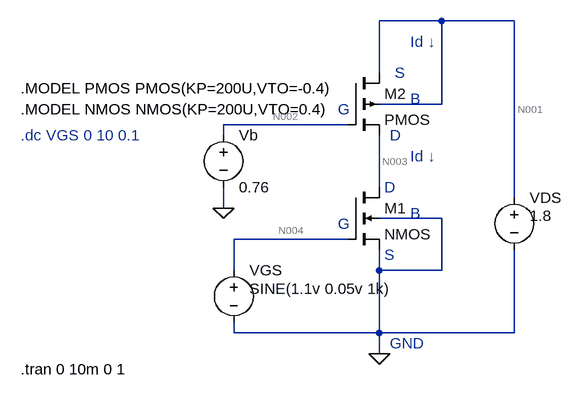
[diagram p0: schematic NMOS-PMOS.asc]
NMOS-PMOS.asc, the LTspice schematic file:
Version 4
SHEET 1 880 680
WIRE 224 -192 128 -192
WIRE 336 -192 224 -192
WIRE 128 -112 128 -192
WIRE 224 -64 224 -192
WIRE 224 -64 128 -64
WIRE 80 -32 -112 -32
WIRE -112 -16 -112 -32
WIRE 128 64 128 -16
WIRE 336 80 336 -192
WIRE -112 96 -112 64
WIRE 224 112 128 112
WIRE 80 144 -96 144
WIRE -96 192 -96 144
WIRE 128 192 128 160
WIRE 224 192 224 112
WIRE 224 192 128 192
WIRE -96 288 -96 272
WIRE 128 288 128 192
WIRE 128 288 -96 288
WIRE 336 288 336 160
WIRE 336 288 128 288
WIRE 128 320 128 288
FLAG 128 320 0
FLAG -112 96 0
DATAFLAG 128 16 ""
SYMBOL nmos4 80 64 R0
SYMATTR InstName M1
SYMATTR Value2 l=1u w=100u
SYMBOL voltage 336 64 R0
WINDOW 3 24 44 Left 2
WINDOW 123 0 0 Left 0
WINDOW 39 0 0 Left 0
SYMATTR Value 1.8
SYMATTR InstName VDS
SYMBOL voltage -96 176 R0
WINDOW 3 24 44 Left 2
WINDOW 123 0 0 Left 0
WINDOW 39 0 0 Left 0
SYMATTR Value SINE(1.1v 0.05v 1k)
SYMATTR InstName VGS
SYMBOL pmos4 80 -112 R0
SYMATTR InstName M2
SYMATTR Value2 l=1u w=146u
SYMBOL voltage -112 -32 R0
WINDOW 123 0 0 Left 0
WINDOW 39 0 0 Left 0
SYMATTR InstName Vb
SYMATTR Value 0.76
TEXT 136 64 Left 2 ;D
TEXT 64 120 Left 2 ;G
TEXT 136 168 Left 2 ;S
TEXT 176 104 Left 2 ;B
TEXT 144 304 Left 2 ;GND
TEXT 176 16 Left 2 ;Id ↓
TEXT -424 -56 Left 2 !.MODEL NMOS NMOS(KP=200U,VTO=0.4)
TEXT -424 344 Left 2 !.tran 0 10m 0 1
TEXT 144 -16 Left 2 ;D
TEXT 64 -56 Left 2 ;G
TEXT 152 -112 Left 2 ;S
TEXT 176 -72 Left 2 ;B
TEXT 176 -160 Left 2 ;Id ↓
TEXT -424 -16 Left 2 ;.dc VGS 0 10 0.1
TEXT -424 -88 Left 2 !.MODEL PMOS PMOS(KP=200U,VTO=-0.4)

The netlist it stands for:
* NMOS-PMOS.asc
M1 N003 N004 0 0 NMOS l=1u w=100u
VDS N001 0 1.8
VGS N004 0 SINE(1.1v 0.05v 1k)
M2 N001 N002 N003 N001 PMOS l=1u w=146u
Vb N002 0 0.76
.model NMOS NMOS
.model PMOS PMOS
.lib standard.mos
* D
* G
* S
* B
* GND
* Id ↓
.MODEL NMOS NMOS(KP=200U,VTO=0.4)
.tran 0 10m 0 1
* D
* G
* S
* B
* Id ↓
* .dc VGS 0 10 0.1
.MODEL PMOS PMOS(KP=200U,VTO=-0.4)
.backanno
.end

* Results of the author's LTspice run, read from the files saved beside the schematic
* Operating Point, zero values left out:
*   V(n003) = 1.432 V
*   V(n004) = 1.1 V
*   V(n001) = 1.8 V
*   V(n002) = 760 mV
*   Id(M2) = 4.9 mA
*   Is(M2) = -4.9 mA
*   Id(M1) = 4.9 mA
*   Ib(M1) = -1.442 pA
*   Is(M1) = -4.9 mA
*   I(Vds) = -4.9 mA
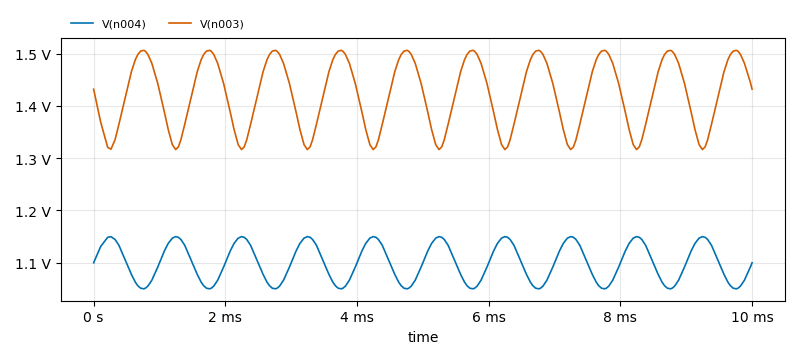
[diagram p1: Transient Analysis of NMOS-PMOS.asc, plotted from the saved traces]
* Transient Analysis, 1 run:
*   V(n004): min 1.05 V, max 1.15 V, average 1.1 V, rms 1.1 V, last 1.1 V
*   V(n003): min 1.316 V, max 1.506 V, average 1.421 V, rms 1.423 V, last 1.432 V